# EAGLE design untitled (EAGLE 9.6.2)
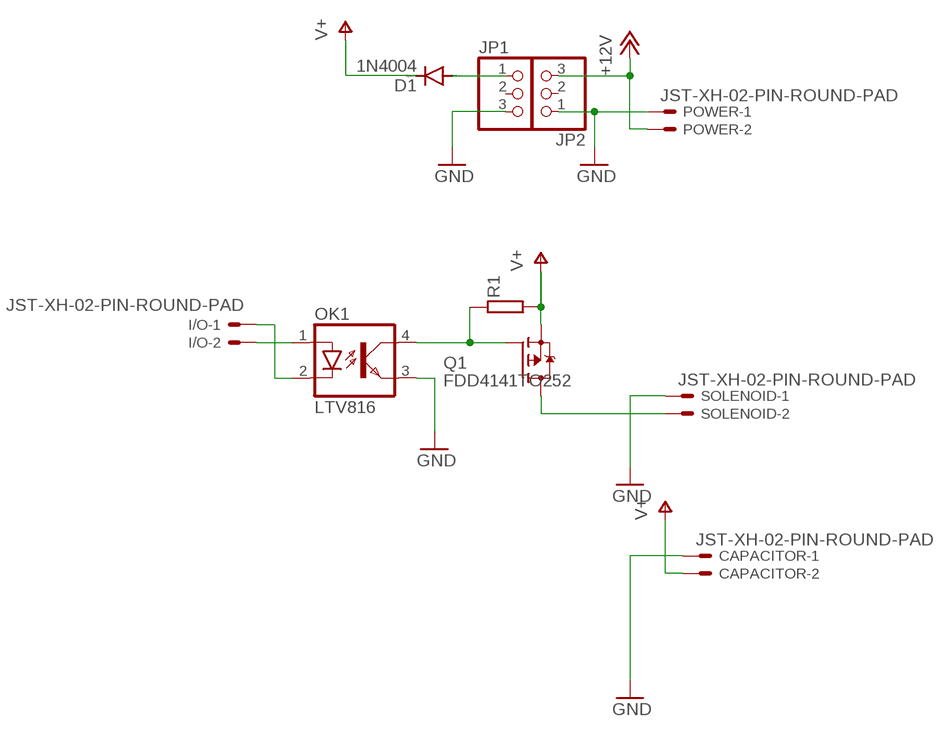
[diagram p0: schematic, sheet 1]

## Parts
CAPACITOR  JST-XH-02-PIN-ROUND-PAD  [JST-XH-02-PACKAGE-ROUND-PAD]
D1  1N4004  [DO41-10]
I/O  JST-XH-02-PIN-ROUND-PAD  [JST-XH-02-PACKAGE-ROUND-PAD]
JP1  PINHD-1X3  [1X03]
JP2  PINHD-1X3  [1X03]
OK1  LTV816  [DIL04]
POWER  JST-XH-02-PIN-ROUND-PAD  [JST-XH-02-PACKAGE-ROUND-PAD]
Q1  FDD4141TO252  [TO252]
R1  RESISTOR1608  [SMD1608]
SOLENOID  JST-XH-02-PIN-ROUND-PAD  [JST-XH-02-PACKAGE-ROUND-PAD]

## Nets
+12V: JP2.3 POWER.2
GND: CAPACITOR.1 JP1.3 JP2.1 OK1.3(EMIT) POWER.1 SOLENOID.1
N$1: Q1.3(D) SOLENOID.2
N$2: OK1.4(COL) Q1.1(G) R1.1
N$3: I/O.2 OK1.1(A)
N$4: D1.A JP1.1
N$5: I/O.1 OK1.2(C)
V+: CAPACITOR.2 D1.C Q1.2(S) R1.2
Unconnected: JP1.2 JP2.2

## Library data of the parts
CAPACITOR I/O POWER SOLENOID = Rembrandt Electronics - JST XH Connectors v1-0:JST-XH-02-PIN: JST XH Connector 2 Pin Wire to board connector. Pitch: 2,54 mm, (0.100") Number of pins: 2 Created by Rembrandt Electronics www.rembrandtelectronics.com
D1 = diode:1N4004: DIODE general purpose rectifier, 1 A
JP1 JP2 = pinhead:PINHD-1X3: PIN HEADER
OK1 = optocoupler:LTV816: OPTO COUPLER Source: LITEON, LTV816.pdf; OC_FARNELL: unknown; OC_NEWARK: unknown
Q1 = transistor-fet:FDD4141: P-Channel PowerTrench® MOSFET Source: FDD4141.pdf
R1 = generic:RESISTOR: Generic Registor

## Board
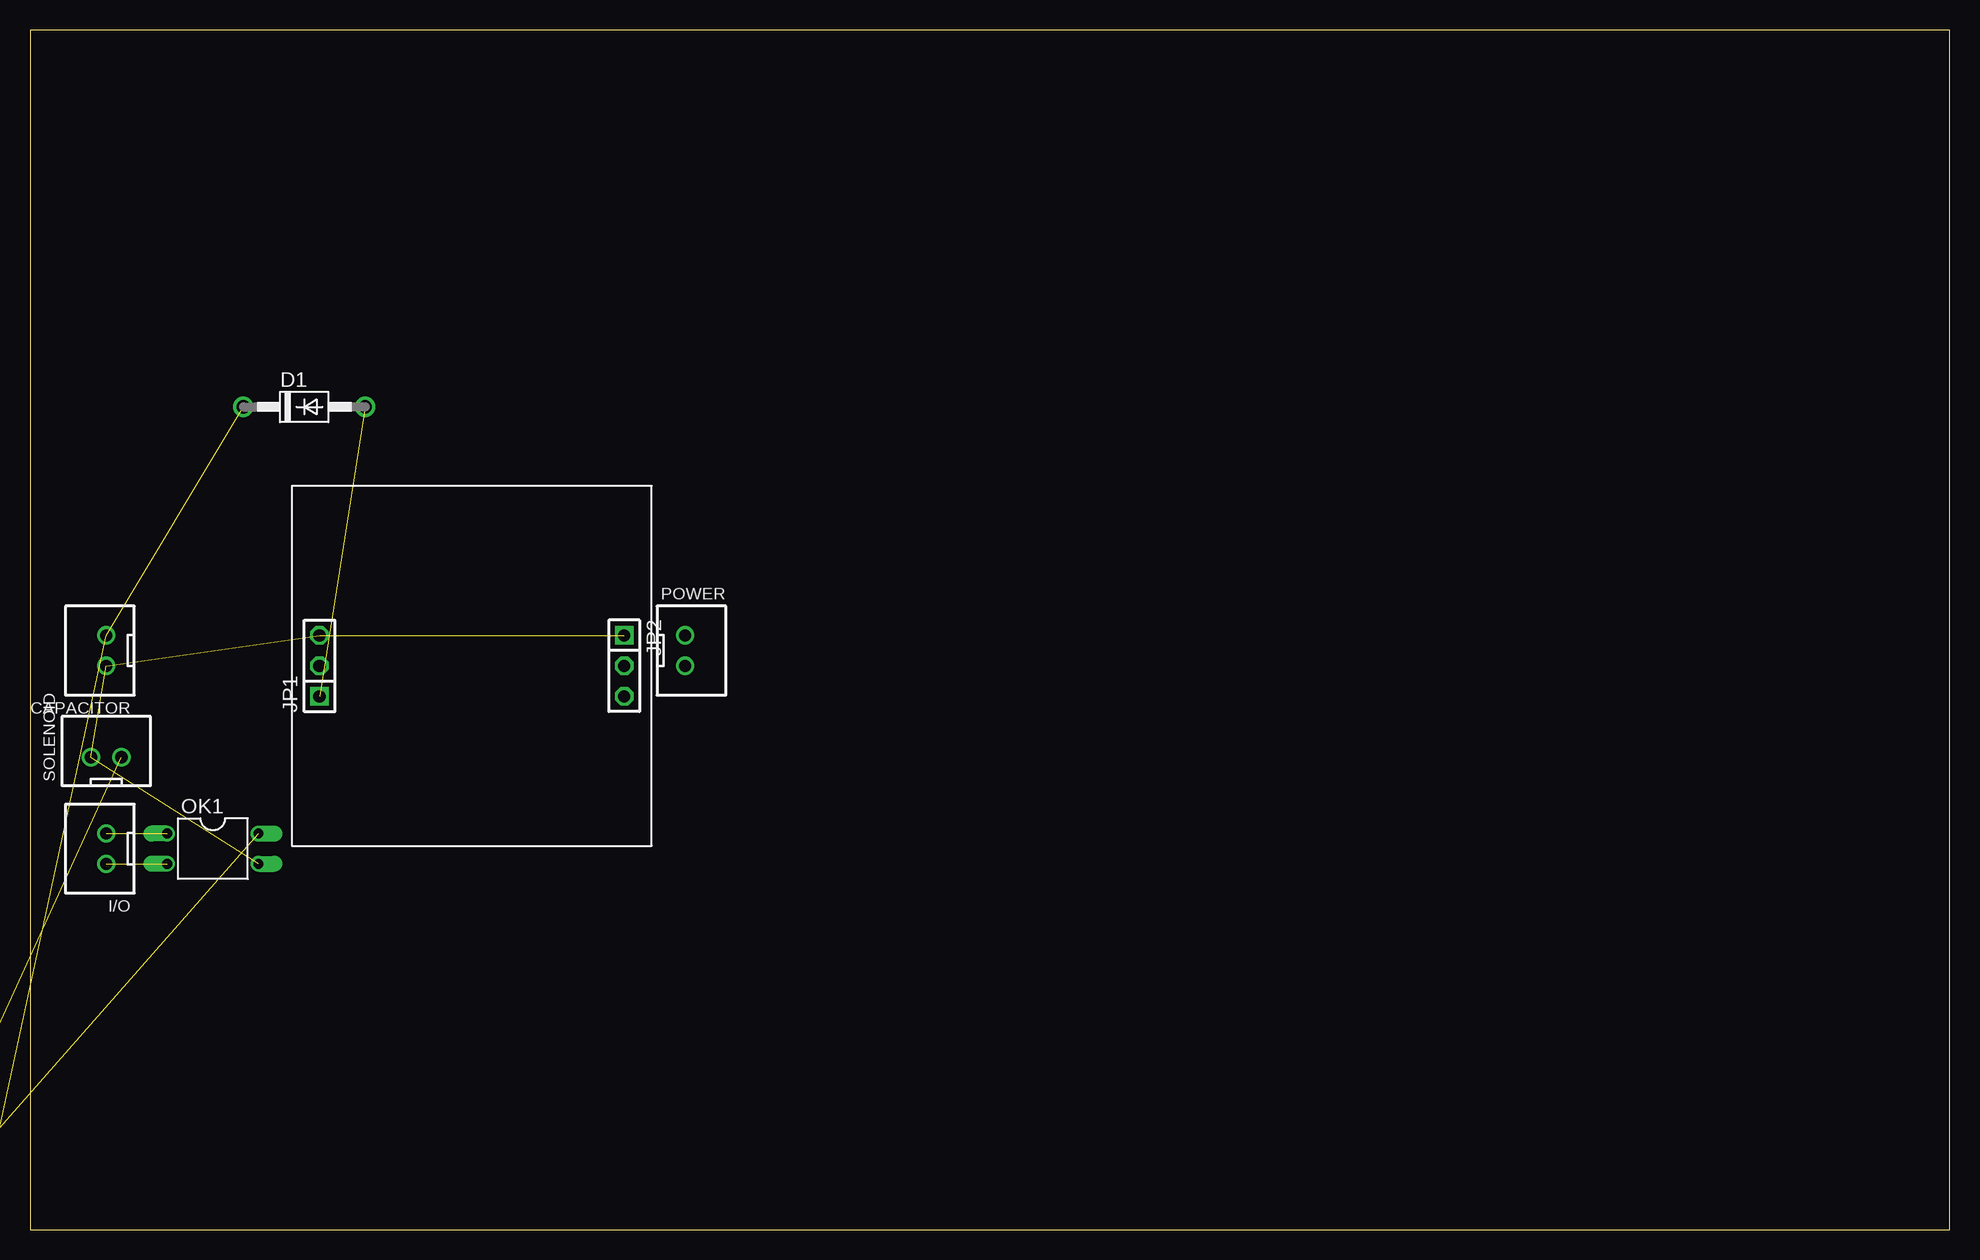
[diagram p1: board, top side]
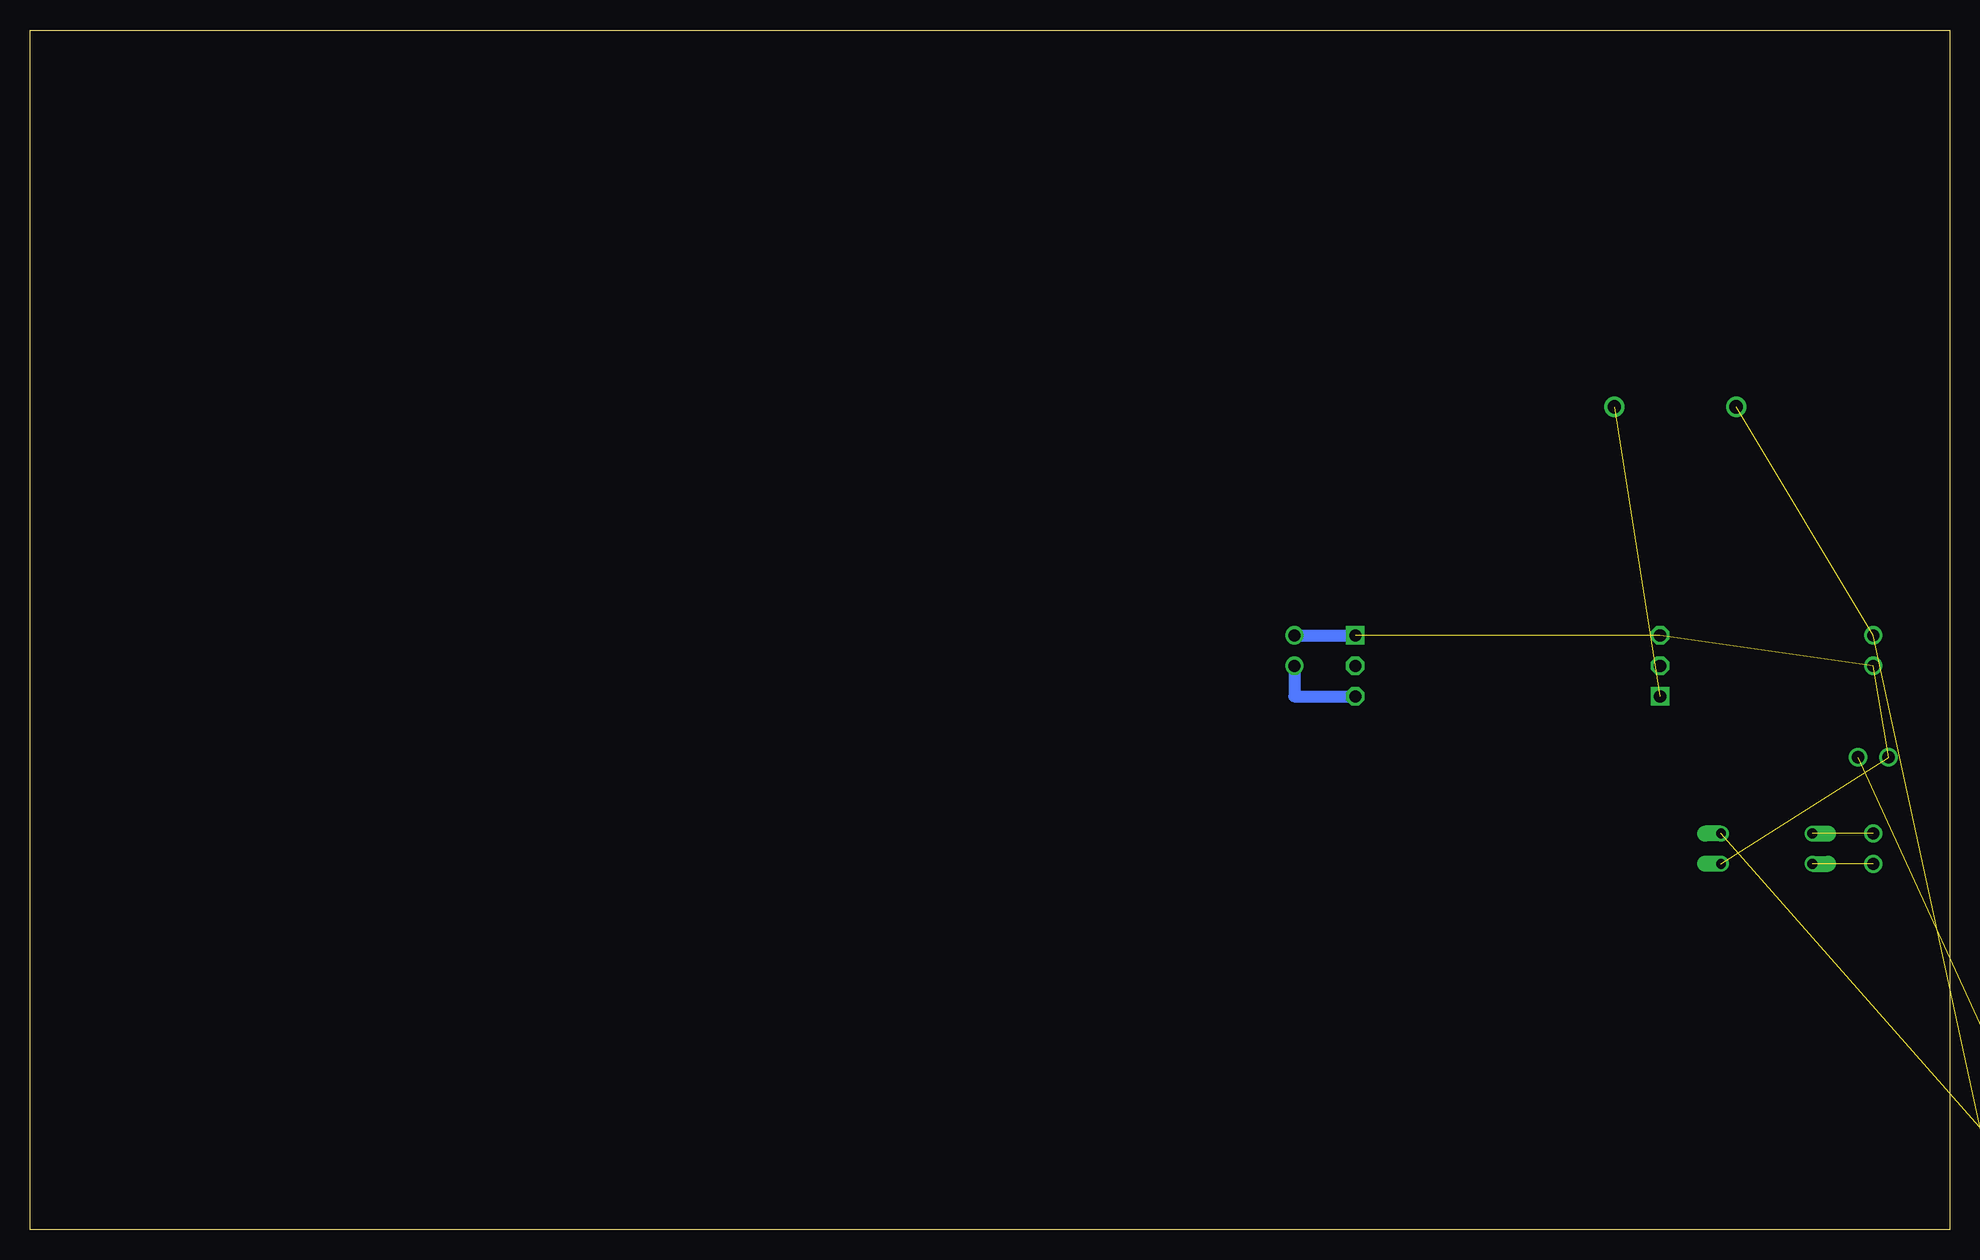
[diagram p2: board, bottom side, seen from below]

Size 160 x 100 mm. Coordinates in mm from the lower left corner, seen from the top.
Outline: 0,0 160,0 160,100 0,100 0,0
Copper layers (1*16): Top 0.035mm / dielectric 0.15mm / Bottom 0.035mm
Design rules "default": minimum track width 6mil, minimum drill 0.35mm, track to track 6mil, track to pad 6mil, pad to pad 6mil, via to via 6mil, smd to smd 6mil, copper to edge 40mil, drill to drill 6mil, minimum pad ring 10mil, minimum via ring 8mil, stop-mask expansion 4mil, vias tented up to drill 0mil, thermal gap 10mil

### Footprints (pad centres in the part's own frame; a part is rotated, then mirrored left to right if it is on the bottom)
JST-XH-02-PACKAGE-ROUND-PAD = drill 1.016: 1 -1.27,0; 2 1.27,0
DO41-10 = drill 1.118: A 5.08,0; C -5.08,0
1X03 = drill 1.016 square: 1 -2.54,0 | drill 1.016 octagon: 2 0,0; 3 2.54,0
DIL04 = drill 0.813 offset: 1 -1.27,-3.81; 2 1.27,-3.81; 3 1.27,3.81; 4 -1.27,3.81
TO252 = smd 1 x 1.6: 1 -2.28,-4.8; 2 2.28,-4.8 | smd 5.4 x 6.2: 3 0,2.5
SMD1608 = smd 1.05 x 1.08: 1 -0.875,0; 2 0.875,0

### Placement (x,y rotation side)
CAPACITOR  6.35,48.26 90 top
D1  22.86,68.58 0 top
I/O  6.35,31.75 90 top
JP1  24.13,46.99 90 top
JP2  49.53,46.99 270 top
OK1  15.24,31.75 270 top
POWER  54.61,48.26 270 top
Q1  -6.35,6.35 0 top  (outside the outline)
R1  -10.16,-2.54 0 top  (outside the outline)
SOLENOID  6.35,39.37 0 top

### Tracks (layer width: path | path; a pad name or v marks a point on that pad's centre or on a via)
+12V
  Bottom 1.016: POWER.2 54.61,44.45 JP2.3
GND  (4 unrouted)
  Bottom 1.016: POWER.1 JP2.1
N$1  (1 unrouted)
N$2  (2 unrouted)
N$3  (1 unrouted)
N$4  (1 unrouted)
N$5  (1 unrouted)
V+  (3 unrouted)